# EAGLE design CO_Monitor (EAGLE 9.6.2)
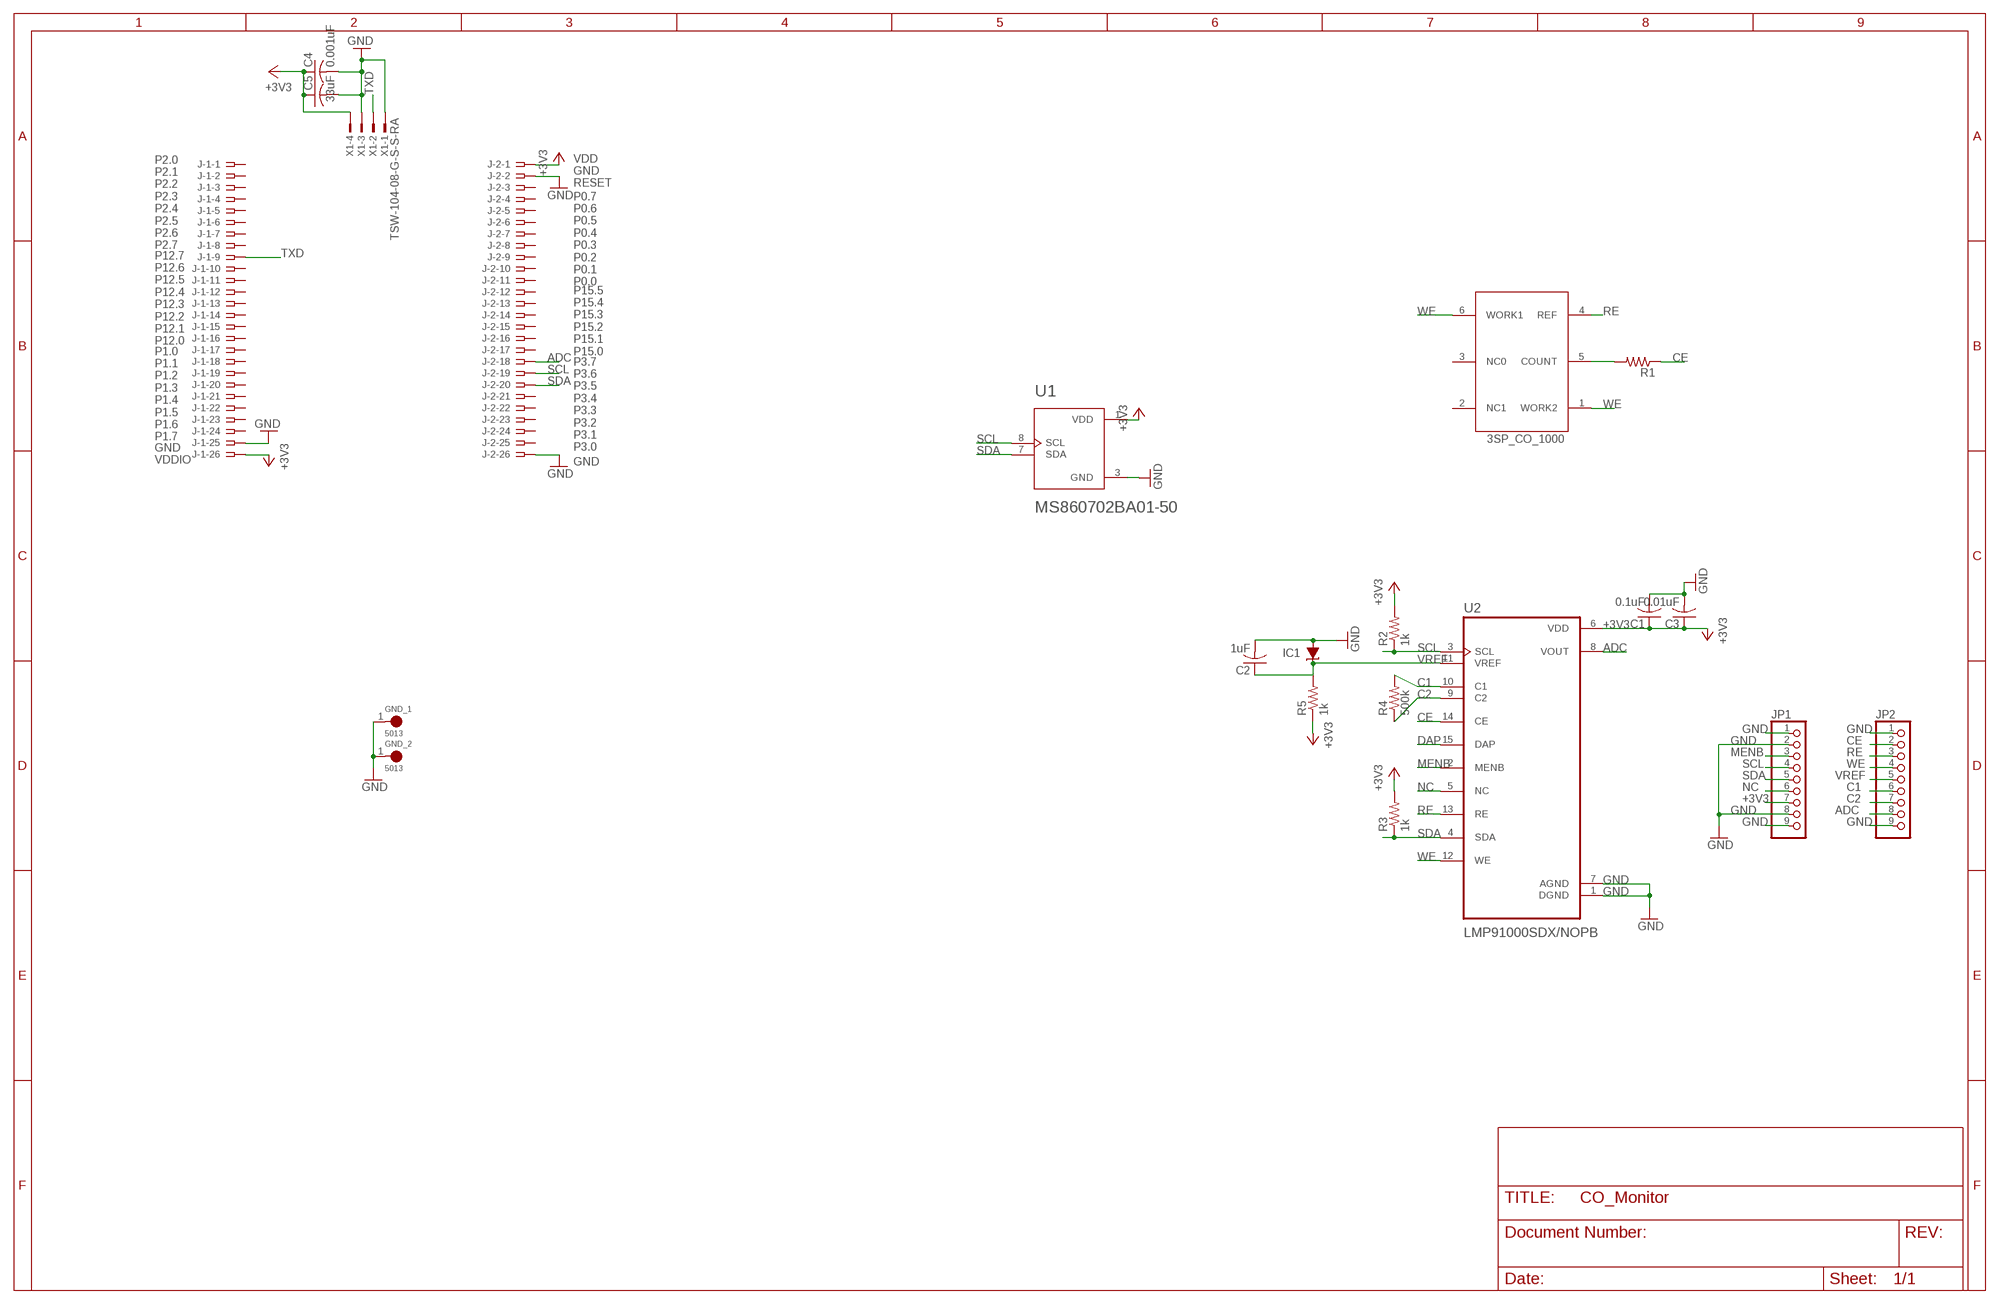
[diagram p0: schematic, sheet 1]

## Parts
C1  0.1uF  C-US050-025X075  [C050-025X075]
C2  1uF  C-US050-025X075  [C050-025X075]
C3  0.01uF  C-US050-025X075  [C050-025X075]
C4  0.001uF  C-US050-025X075  [C050-025X075]
C5  33uF  C-US050-025X075  [C050-025X075]
GND_1  5013  [TESTPOINT_5013]
GND_2  5013  [TESTPOINT_5013]
IC1  LM4041D12LP  [LP_O-PBCY-W3]
J-1  SSW-126-02-G-S  [SSW-126-02-G-S]
J-2  SSW-126-02-G-S  [SSW-126-02-G-S]
JP1  PINHD-1X9  [1X09]
JP2  PINHD-1X9  [1X09]
R1  50  R-US_0207/10  [0207/10]
R2  1k  R-US_0207/10  [0207/10]
R3  1k  R-US_0207/10  [0207/10]
R4  500k  R-US_0207/10  [0207/10]
R5  1k  R-US_0207/10  [0207/10]
U1  MS860702BA01-50  [TE_MS860702BA01-50]
U2  LMP91000SDX/NOPB  [SON50P400X400X80-15N]
U$1  3SP_CO_1000  [3SP_CO_1000]
X1  TSW-104-08-G-S-S-RA  [TSW-104-08-G-S-RA]

## Nets
+3V3: C1.1 C3.1 C4.1 C5.1 J-1.26 J-2.1 JP1.7 R2.2 R3.2 R5.1 U1.1(VDD) U2.6(VDD) X1.4
ADC: J-2.18 JP2.8 U2.8(VOUT)
C1: JP2.6 R4.2 U2.10(C1)
C2: JP2.7 R4.1 U2.9(C2)
CE: JP2.2 R1.1 U2.14(CE)
DAP: U2.15(DAP)
GND: C1.2 C2.2 C3.2 C4.2 C5.2 GND_1.1(TP) GND_2.1(TP) IC1.3(A) J-1.25 J-2.2 J-2.26 JP1.1 JP1.2 JP1.8 JP1.9 JP2.1 JP2.9 U1.3(GND) U2.1(DGND) U2.7(AGND) X1.1 X1.3
MENB: JP1.3 U2.2(MENB)
N$1: R1.2 U$1.5(COUNT)
NC: JP1.6 U2.5(NC)
RE: JP2.3 U2.13(RE) U$1.4(REF)
SCL: J-2.19 JP1.4 R2.1 U1.8(SCL) U2.3(SCL)
SDA: J-2.20 JP1.5 R3.1 U1.7(SDA) U2.4(SDA)
TXD: J-1.9 X1.2
VREF: C2.1 IC1.2(C) JP2.5 R5.2 U2.11(VREF)
WE: JP2.4 U2.12(WE) U$1.1(WORK2) U$1.6(WORK1)
Unconnected: J-1.1 J-1.2 J-1.3 J-1.4 J-1.5 J-1.6 J-1.7 J-1.8 J-1.10 J-1.11 J-1.12 J-1.13 J-1.14 J-1.15 J-1.16 J-1.17 J-1.18 J-1.19 J-1.20 J-1.21 J-1.22 J-1.23 J-1.24 J-2.3 J-2.4 J-2.5 J-2.6 J-2.7 J-2.8 J-2.9 J-2.10 J-2.11 J-2.12 J-2.13 J-2.14 J-2.15 J-2.16 J-2.17 J-2.21 J-2.22 J-2.23 J-2.24 J-2.25 U$1.2(NC1) U$1.3(NC0)

## Notes on the sheet
- VDD
  GND
  RESET
- P2.0
  P2.1
  P2.2
  P2.3
  P2.4
  P2.5
  P2.6
  P2.7
- P0.7
  P0.6
  P0.5
  P0.4
  P0.3
  P0.2
  P0.1
  P0.0
- P12.7
  P12.6
  P12.5
  P12.4
  P12.3
  P12.2
  P12.1
  P12.0
- P15.5
  P15.4
  P15.3
  P15.2
  P15.1
  P15.0
- P1.0
  P1.1
  P1.2
  P1.3
  P1.4
  P1.5
  P1.6
  P1.7
- P3.7
  P3.6
  P3.5
  P3.4
  P3.3
  P3.2
  P3.1
  P3.0
- GND
  VDDIO
- GND

## Library data of the parts
C1-C5 = resistor:C-US: CAPACITOR, American symbol
GND_1 GND_2 = 5013:5013: Test Point; Orange; Thru-Hole; Snap-Fit; SilverPlate; 0.063in. Dia.; 0.445In.; AVAILABILITY: Unavailable; DESCRIPTION: Test Point; Orange; Thru-Hole; Snap-Fit; SilverPlate; 0.063in. Dia.; 0.445In.; MF: Keystone Electronics; MP: 5013; PACKAGE: TO-5 Keystone; PRICE: None
IC1 = texas:LM4041: PRECISION MICROPOWER SHUNT VOLTAGE REFERENCE Source: http://focus.ti.com/lit/ds/slcs146e/slcs146e.pdf; MPN: LM4041D12ILP; OC_FARNELL: unknown; OC_NEWARK: 18M2431
J-1 J-2 = con-samtec:SSW-126-02-G-S: THROUGH-HOLE .025" SQ POST SOCKET Source: Samtec SSW.pdf; MF: Samtec Inc.; MPN: SSW-126-02-G-S; OC_FARNELL: unknown; OC_NEWARK: 11P9742
JP1 JP2 = pinhead:PINHD-1X9: PIN HEADER
R1-R5 = resistor:R-US_: RESISTOR, American symbol
U1 = MS860702BA01-50:MS860702BA01-50: Pressure Temp Humidity Sensor; ARROW_ELECTRONICS-PURCHASE-URL: https://snapeda.com/shop?store=Arrow+Electronics&id=555057; AVAILABILITY: Unavailable; COMMENT: MS860702BA01-50; DESCRIPTION: PHT SENSOR, 29PSI-10MBAR, QFN-8; DIGIKEY-PURCHASE-URL: https://snapeda.com/shop?store=DigiKey&id=555057; EU_ROHS_COMPLIANCE: Compliant; MF: TE Connectivity; MOUSER-PURCHASE-URL: https://snapeda.com/shop?store=Mouser&id=555057; MP: MS860702BA01-50; PACKAGE: QFN-8 TE Connectivity; PRICE: None
U2 = LMP91000SDX_NOPB:LMP91000SDX/NOPB: None; AVAILABILITY: Unavailable; DESCRIPTION: Configurable AFE Potentiostat for Low-Power Chemical Sensing Applications 14-WSON -40 to 85; MF: Texas Instruments; MP: LMP91000SDX/NOPB; PACKAGE: WFDFN-14 Texas Instruments; PRICE: None
U$1 = 3SP_CO_1000:3SP_CO_1000
X1 = con-samtec:TSW-104-*-G-S: THROUGH-HOLE .025" SQ POST HEADER Source: Samtec TSW.pdf; MF: Samtec Inc.; MPN: TSW-104-08-G-S-RA

## Net classes
0 default: width 0.203 mm, clearance 0.203 mm
1 GND/voltage: width 0.254 mm, drill 0.152 mm, clearance 0.203 mm

## Board
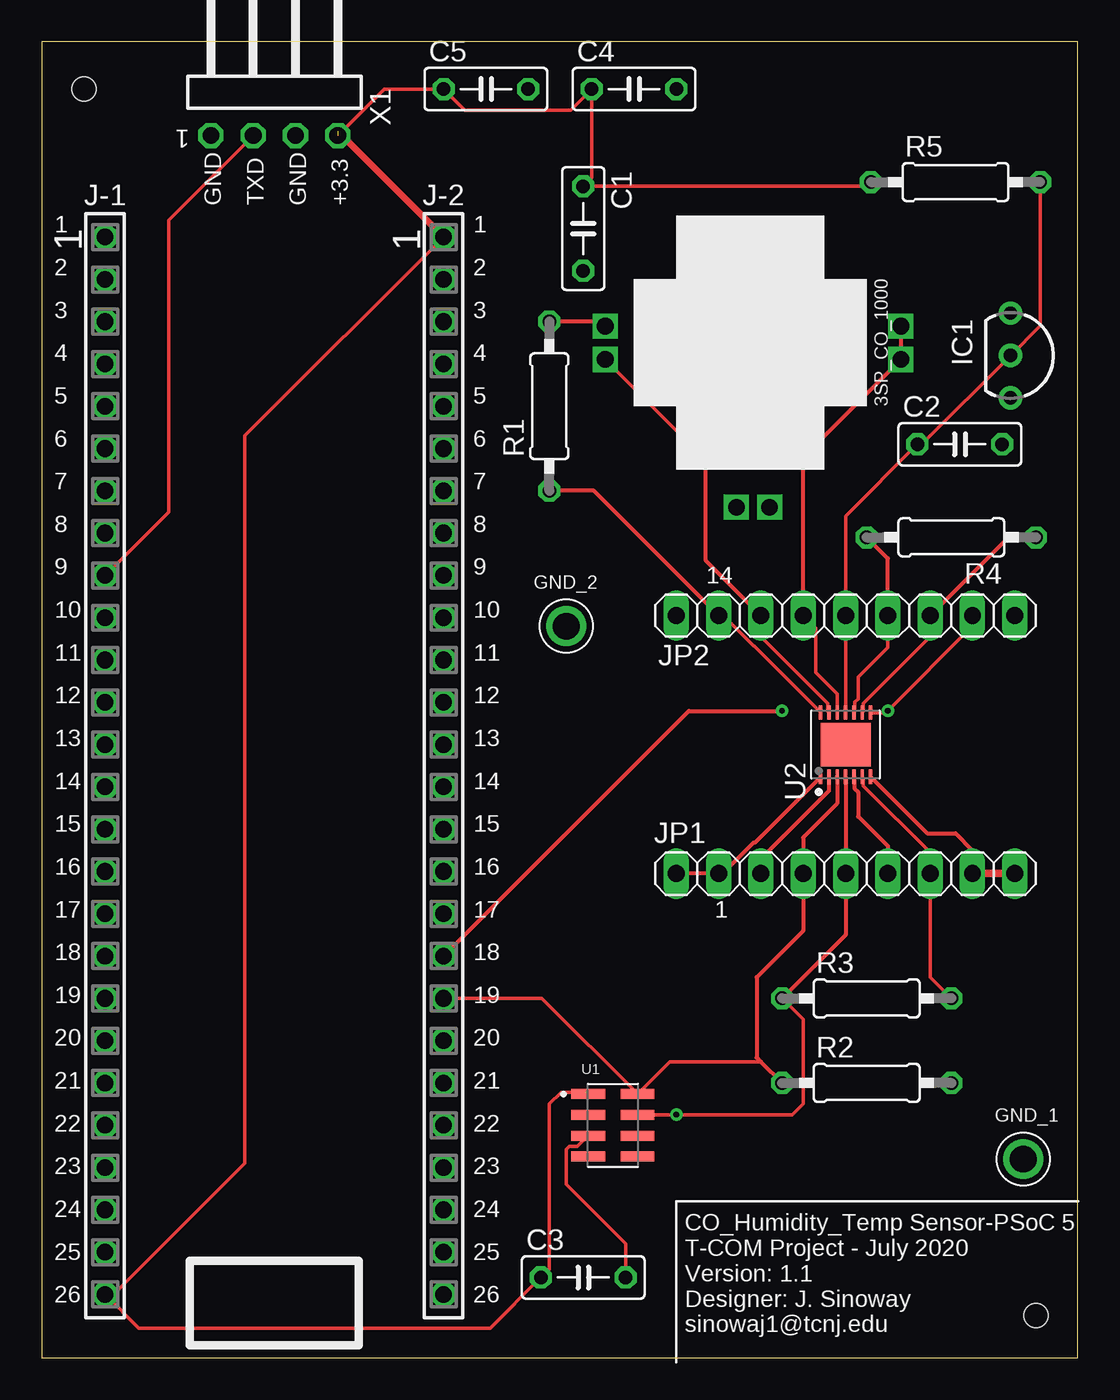
[diagram p1: board, top side]
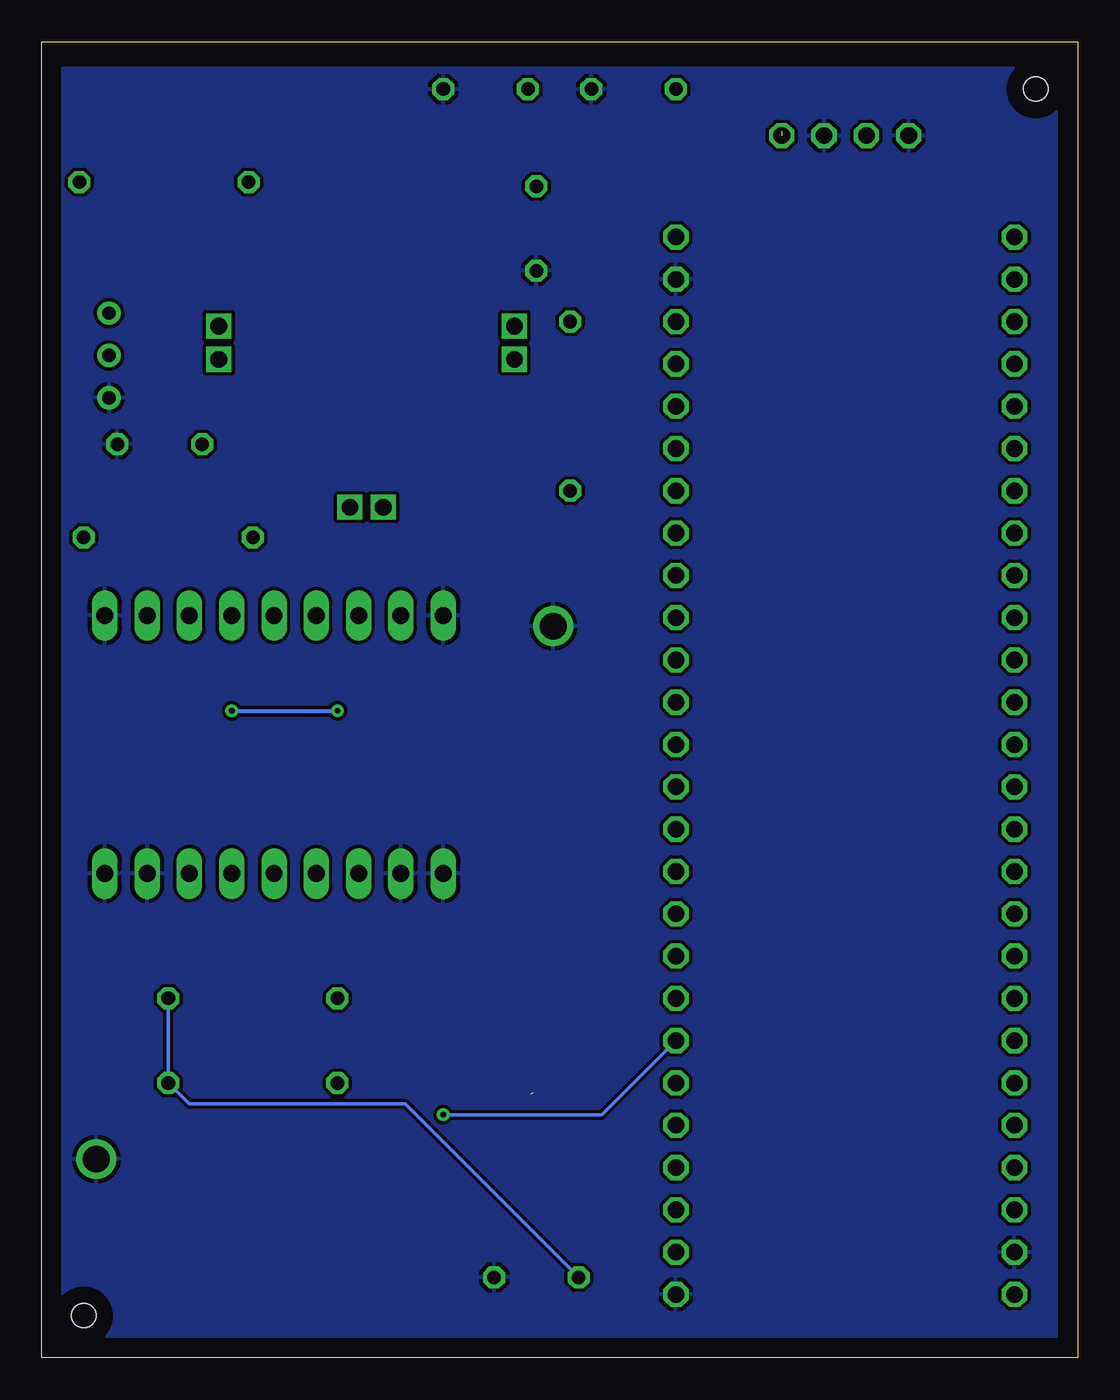
[diagram p2: board, bottom side, seen from below]

Size 62.21 x 79.05 mm. Coordinates in mm from the lower left corner, seen from the top.
Outline: 0,0 62.21,0 62.21,79.05 0,79.05 0,0
Copper layers (1*16): Top 0.035mm / dielectric 1.5mm / Bottom 0.035mm
Design rules "default": minimum track width 6mil, minimum drill 0.35mm, track to track 6mil, track to pad 6mil, pad to pad 6mil, via to via 6mil, smd to smd 6mil, copper to edge 40mil, drill to drill 6mil, minimum pad ring 10mil, minimum via ring 8mil, stop-mask expansion 4mil, vias tented up to drill 0mil, thermal gap 10mil
Holes 1.45 mm at 2.54,76.2 59.69,2.54

### Footprints (pad centres in the part's own frame; a part is rotated, then mirrored left to right if it is on the bottom)
C050-025X075 = drill 0.813 octagon: 1 -2.54,0; 2 2.54,0
TESTPOINT_5013 = drill 1.6: 1 0,0
LP_O-PBCY-W3 = drill 0.8 pad 1.4: 1 -2.54,0; 2 0,0; 3 2.54,0
SSW-126-02-G-S = drill 1 pad 1.5 octagon: 1 -31.75,0; 2 -29.21,0; 3 -26.67,0; 4 -24.13,0; 5 -21.59,0; 6 -19.05,0; 7 -16.51,0; 8 -13.97,0; 9 -11.43,0; 10 -8.89,0; 11 -6.35,0; 12 -3.81,0; 13 -1.27,0; 14 1.27,0; 15 3.81,0; 16 6.35,0; 17 8.89,0; 18 11.43,0; 19 13.97,0; 20 16.51,0; 21 19.05,0; 22 21.59,0; 23 24.13,0; 24 26.67,0; 25 29.21,0; 26 31.75,0
1X09 = drill 1.016 long: 1 -10.16,0; 2 -7.62,0; 3 -5.08,0; 4 -2.54,0; 5 0,0; 6 2.54,0; 7 5.08,0; 8 7.62,0; 9 10.16,0
0207/10 = drill 0.813 octagon: 1 -5.08,0; 2 5.08,0
TE_MS860702BA01-50 = smd 2.04 x 0.6: 1 -1.481,1.875; 2 -1.481,0.625; 3 -1.481,-0.625; 4 -1.481,-1.875; 5 1.481,-1.875; 6 1.481,-0.625; 7 1.481,0.625; 8 1.481,1.875
SON50P400X400X80-15N = smd 0.86 x 0.27: 1 -1.935,1.5; 2 -1.935,1; 3 -1.935,0.5; 4 -1.935,0; 5 -1.935,-0.5; 6 -1.935,-1; 7 -1.935,-1.5; 8 1.935,-1.5; 9 1.935,-1; 10 1.935,-0.5; 11 1.935,0; 12 1.935,0.5; 13 1.935,1; 14 1.935,1.5 | smd 2.6 x 3: 15 0,0
3SP_CO_1000 = drill 1 square: 1 -1,-14.75; 2 -9.875,-6.875; 3 -9.875,-4.875; 4 -1,3; 5 1,3; 6 1,-14.75
TSW-104-08-G-S-RA = drill 1 pad 1.5 octagon: 1 3.81,1.524; 2 1.27,1.524; 3 -1.27,1.524; 4 -3.81,1.524

### Placement (x,y rotation side)
C1  32.51,67.82 270 top
C2  55.12,54.86 0 top
C3  32.51,4.83 0 top
C4  35.56,76.2 0 top
C5  26.67,76.2 0 top
GND_1  58.93,11.94 0 top
GND_2  31.5,43.94 0 top
IC1  58.17,60.2 270 top
J-1  3.81,35.56 270 top
J-2  24.13,35.56 270 top
JP1  48.26,29.08 0 top
JP2  48.26,44.58 0 top
R1  30.48,57.15 90 top
R2  49.53,16.51 0 top
R3  49.53,21.59 0 top
R4  54.61,49.28 180 top
R5  54.86,70.61 0 top
U1  34.29,13.97 0 top
U2  48.26,36.83 90 top
U$1  36.83,60.96 90 top
X1  13.97,74.93 180 top

### Tracks (layer width: path | path; a pad name or v marks a point on that pad's centre or on a via)
+3V3  (2 unrouted)
  Top 0.203: J-2.1 12.19,55.37 12.19,11.68 4.32,3.81 J-1.26 5.84,1.78 26.92,1.78 C3.1 30.48,5.33 30.48,15.24 31.19,15.95 32.71,15.95 | R5.1 49.53,70.36 C1.1 33.02,70.87 C4.1 31.75,74.93 25.4,74.93 C5.1 20.57,76.2 X1.4 | U2.6 49.32,34.84 49.32,34.36 53.34,30.34 JP1.7 53.34,22.86 R3.2
  Top 0.406: 17.78,73.66 J-2.1
  Bottom 0.203: C3.1 40.39,15.24 53.34,15.24 R2.2 R3.2
ADC  (via drill 0.35)
  Top 0.203: v50.8,38.86 55.88,43.94 JP2.8
  Top 0.254: J-2.18 38.86,38.86 v44.45,38.86 | U2.8 50.8,38.77 v50.8,38.86
  Bottom 0.254: v50.8,38.86 v44.45,38.86
C1
  Top 0.203: U2.10 48.82,38.83 48.82,39.38 49.02,39.58 49.02,40.89 50.8,42.67 JP2.6
  Top 0.254: JP2.6 50.8,48.01 R4.2
C2
  Top 0.203: U2.9 49.32,38.83 49.32,39.3 53.34,43.32 JP2.7
  Top 0.254: JP2.7 58.04,49.28 R4.1
CE
  Top 0.203: U2.14 42.78,42.75 42.74,42.75 40.91,44.58 JP2.2
  Top 0.254: JP2.2 33.15,52.07 R1.1
GND
  Top 0.203: C3.2 35.05,6.86 31.48,10.43 31.48,12.52 31.66,12.7 32.16,12.7 U1.3
  Top 0.254: U2.7 53.16,31.5 54.86,31.5 55.88,30.48 JP1.8 | U2.1 42.8,30.94 42.73,30.94 40.87,29.08 JP1.2 JP1.1
  Top 0.457: JP1.9 JP1.8
  pour Bottom: 1.27,77.47 60.96,77.47 60.96,1.27 1.27,1.27
MENB
  Top 0.254: U2.2 47.26,34.05 43.18,29.97 JP1.3
N$1
  Top 0.254: U$1.5 33.56,62.23 R1.2
NC
  Top 0.254: U2.5 48.8,34.86 48.8,34.2 49.02,33.97 49.02,32.51 50.8,30.73 JP1.6
RE
  Top 0.203: U2.13 47.2,38.83 47.2,39.3 43.18,43.32 JP2.3 | U$1.4 39.88,53.91
  Top 0.254: JP2.3 39.88,47.88 39.88,53.59 39.88,53.91
SCL
  Top 0.203: J-2.19 30.03,21.59 U1.8 37.71,17.78 38.1,17.78 43.18,17.78
  Top 0.254: U2.3 47.76,33.28 45.72,31.24 JP1.4 45.72,25.65 42.93,22.86 42.93,18.03 43.18,17.78 R2.1
SDA  (via drill 0.35)
  Top 0.203: R3.1 45.72,20.32 45.72,15.24 45.08,14.6 38.11,14.6 | 38.11,14.6 v38.1,14.61 38.09,14.6 | U1.7 38.11,14.6
  Top 0.254: U2.4 JP1.5 48.26,25.4 R3.1
  Bottom 0.203: v38.1,14.61 28.57,14.61 J-2.20
TXD
  Top 0.203: J-1.9 7.62,50.8 7.62,68.33 X1.2
VREF
  Top 0.203: U2.11 JP2.5 48.26,50.55 C2.1 52.83,54.86 IC1.2 59.94,61.98 R5.2
WE
  Top 0.203: U2.12 47.76,39.87 46.48,41.15 46.48,43.81 JP2.4
  Top 0.254: JP2.4 45.72,54.1 U$1.1 U$1.6

### Text on the board
tPlace: GND / TXD / GND / +3.3 | 14 | 1 | CO_Humidity_Temp Sensor-PSoC 5 / T-COM Project - July 2020 / Version: 1.1 / Designer: J. Sinoway / sinowaj1@tcnj.edu
tNames: 1 / 2 / 3 / 4 / 5 / 6 / 7 / 8 / 9 / 10 / 11 / 12 / 13 / 14 / 15 / 16 / 17 / 18 / 19 / 20 / 21 / 22 / 23 / 24 / 25 / 26 | 1 / 2 / 3 / 4 / 5 / 6 / 7 / 8 / 9 / 10 / 11 / 12 / 13 / 14 / 15 / 16 / 17 / 18 / 19 / 20 / 21 / 22 / 23 / 24 / 25 / 26